# EAGLE design eagle (EAGLE 9.4.2)
CNAME: rk8 HAT; CREVISION: level 3; DESIGNER: Christophe VG
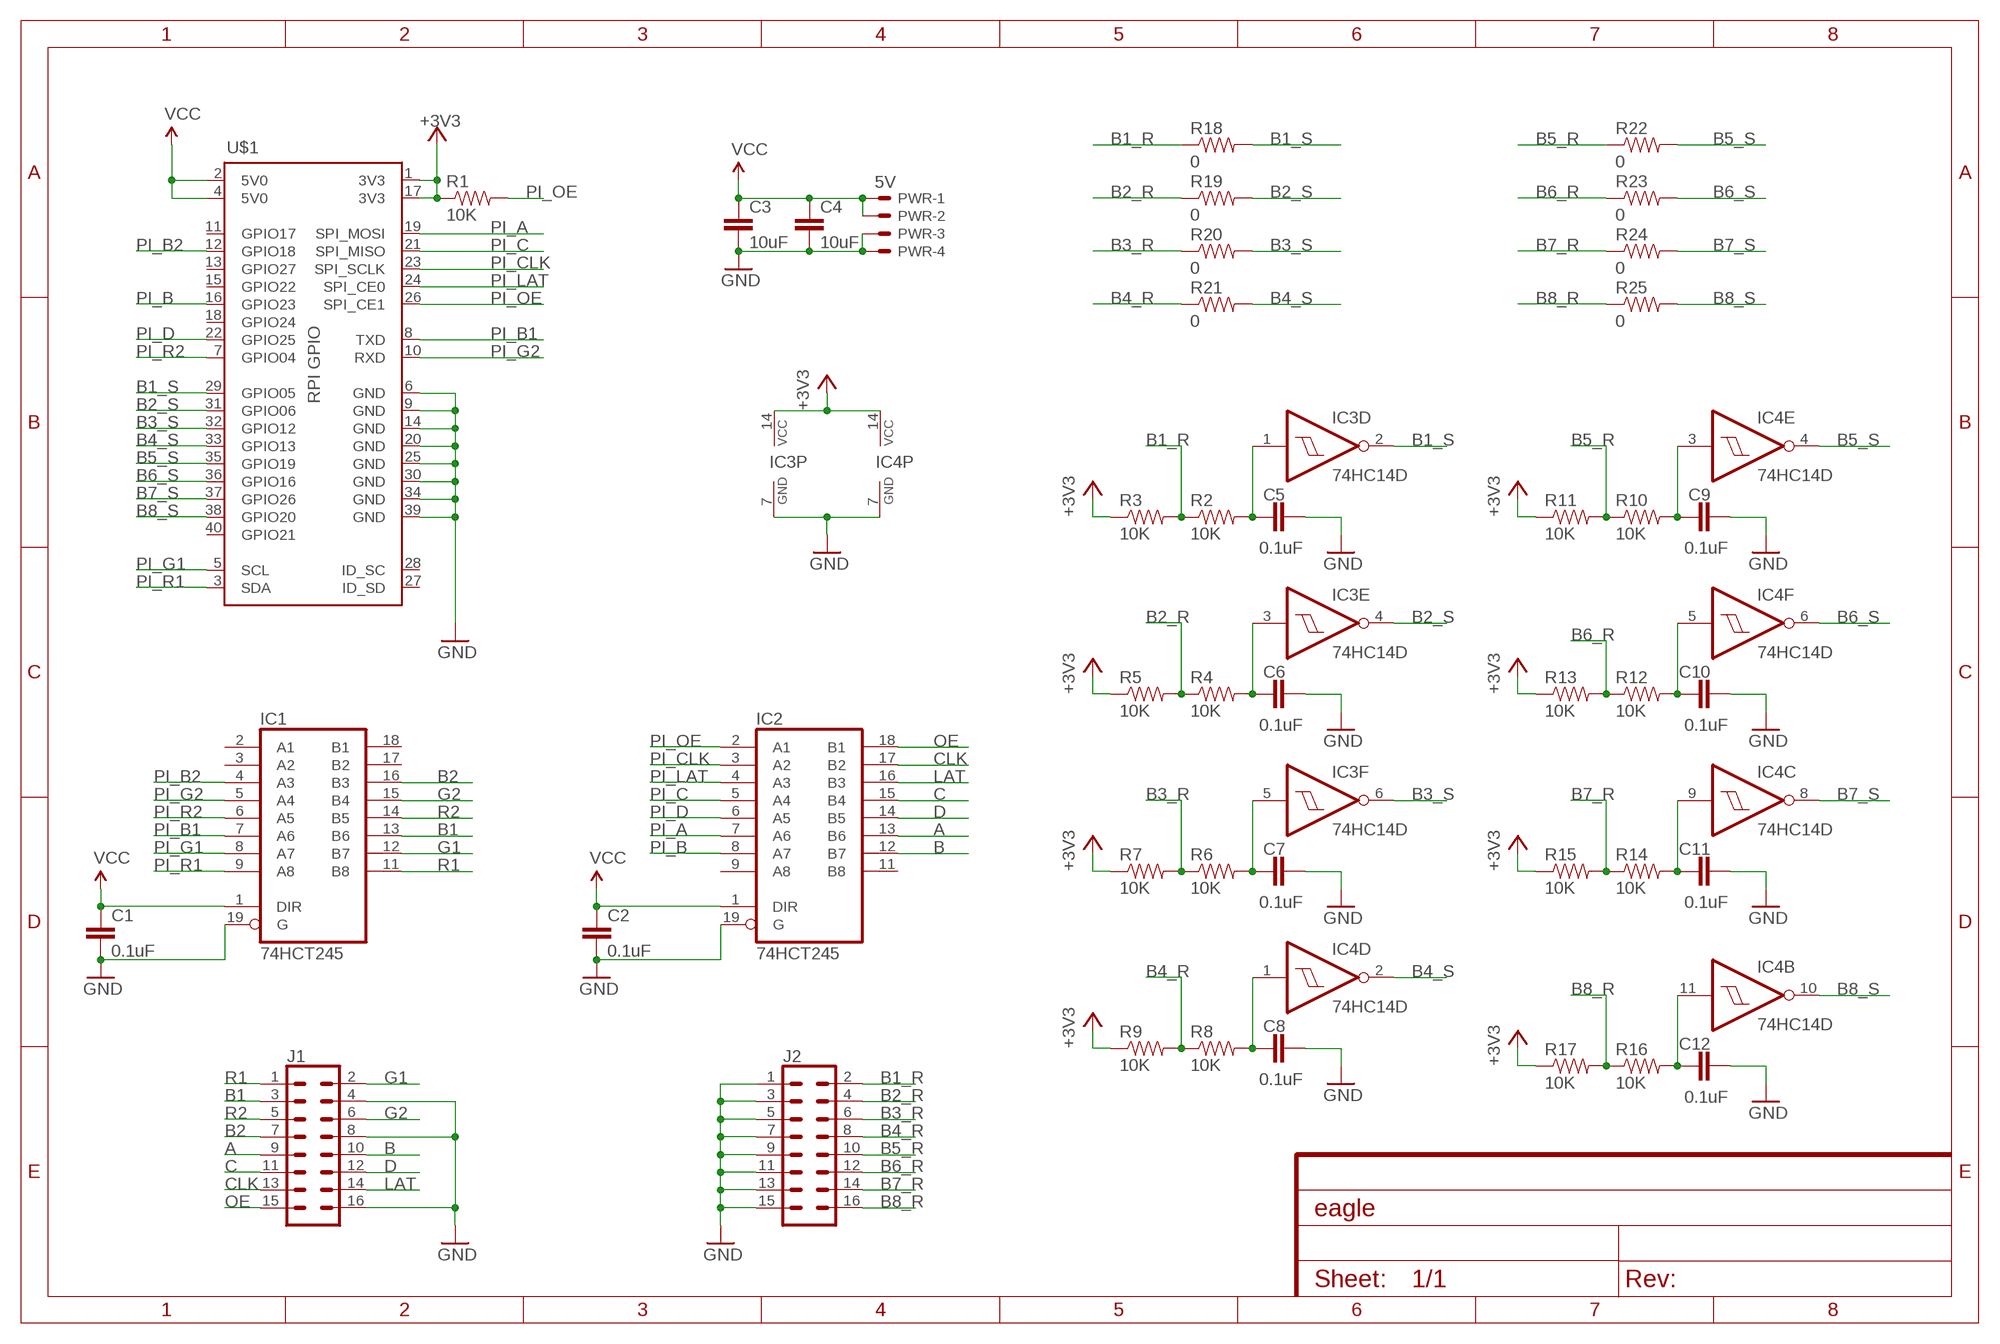
[diagram p0: schematic, sheet 1]

## Parts
C1  0.1uF  CAP0805  [0805]
C2  0.1uF  CAP0805  [0805]
C3  10uF  CAP0805  [0805]
C4  10uF  CAP0805  [0805]
C5  0.1uF  CAP0805  [0805]
C6  0.1uF  CAP0805  [0805]
C7  0.1uF  CAP0805  [0805]
C8  0.1uF  CAP0805  [0805]
C9  0.1uF  CAP0805  [0805]
C10  0.1uF  CAP0805  [0805]
C11  0.1uF  CAP0805  [0805]
C12  0.1uF  CAP0805  [0805]
IC1  74HCT245  74HCT245DW  [SO20W]
IC2  74HCT245  74HCT245DW  [SO20W]
IC3  74HC14D  [SO14]
IC4  74HC14D  [SO14]
J1  CONN_08X2_SHROUD  [2X8-SHROUDED_LOCK]
J2  CONN_08X2_SHROUD  [2X8-SHROUDED_LOCK]
PWR  5V  KK-156-4  [KK-156-4]
R1  10K  RESISTOR0805-RES  [0805]
R2  10K  RESISTOR0805-RES  [0805]
R3  10K  RESISTOR0805-RES  [0805]
R4  10K  RESISTOR0805-RES  [0805]
R5  10K  RESISTOR0805-RES  [0805]
R6  10K  RESISTOR0805-RES  [0805]
R7  10K  RESISTOR0805-RES  [0805]
R8  10K  RESISTOR0805-RES  [0805]
R9  10K  RESISTOR0805-RES  [0805]
R10  10K  RESISTOR0805-RES  [0805]
R11  10K  RESISTOR0805-RES  [0805]
R12  10K  RESISTOR0805-RES  [0805]
R13  10K  RESISTOR0805-RES  [0805]
R14  10K  RESISTOR0805-RES  [0805]
R15  10K  RESISTOR0805-RES  [0805]
R16  10K  RESISTOR0805-RES  [0805]
R17  10K  RESISTOR0805-RES  [0805]
R18  0  RESISTOR0805-RES  [0805]
R19  0  RESISTOR0805-RES  [0805]
R20  0  RESISTOR0805-RES  [0805]
R21  0  RESISTOR0805-RES  [0805]
R22  0  RESISTOR0805-RES  [0805]
R23  0  RESISTOR0805-RES  [0805]
R24  0  RESISTOR0805-RES  [0805]
R25  0  RESISTOR0805-RES  [0805]
U$1  RPI3_HATNO_DF  [RASPI_BOARD_B+HAT]

## Nets
+3V3: IC3.14(P:VCC) IC4.14(P:VCC) R1.1 R3.1 R5.1 R7.1 R9.1 R11.1 R13.1 R15.1 R17.1 U$1.1(3V3) U$1.17(3V3)
A: IC2.13(B6) J1.9
B: IC2.12(B7) J1.10
B1: IC1.13(B6) J1.3
B1_R: J2.2 R2.1 R3.2 R18.1
B1_S: IC3.2(D:O) R18.2 U$1.29(GPIO05)
B2: IC1.16(B3) J1.7
B2_R: J2.4 R4.1 R5.2 R19.1
B2_S: IC3.4(E:O) R19.2 U$1.31(GPIO06)
B3_R: J2.6 R6.1 R7.2 R20.1
B3_S: IC3.6(F:O) R20.2 U$1.32(GPIO12)
B4_R: J2.8 R8.1 R9.2 R21.1
B4_S: IC4.2(D:O) R21.2 U$1.33(GPIO13)
B5_R: J2.10 R10.1 R11.2 R22.1
B5_S: IC4.4(E:O) R22.2 U$1.35(GPIO19)
B6_R: J2.12 R12.1 R13.2 R23.1
B6_S: IC4.6(F:O) R23.2 U$1.36(GPIO16)
B7_R: J2.14 R14.1 R15.2 R24.1
B7_S: IC4.8(C:O) R24.2 U$1.37(GPIO26)
B8_R: J2.16 R16.1 R17.2 R25.1
B8_S: IC4.10(B:O) R25.2 U$1.38(GPIO20)
C: IC2.15(B4) J1.11
CLK: IC2.17(B2) J1.13
D: IC2.14(B5) J1.12
G1: IC1.12(B7) J1.2
G2: IC1.15(B4) J1.6
GND: C1.2 C2.2 C3.2 C4.2 C5.2 C6.2 C7.2 C8.2 C9.2 C10.2 C11.2 C12.2 IC1.19(G) IC2.19(G) IC3.7(P:GND) IC4.7(P:GND) J1.4 J1.8 J1.16 J2.1 J2.3 J2.5 J2.7 J2.9 J2.11 J2.13 J2.15 PWR.3 PWR.4 U$1.6(GND) U$1.9(GND) U$1.14(GND) U$1.20(GND) U$1.25(GND) U$1.30(GND) U$1.34(GND) U$1.39(GND)
LAT: IC2.16(B3) J1.14
N$1: C5.1 IC3.1(D:I) R2.2
N$2: C6.1 IC3.3(E:I) R4.2
N$3: C7.1 IC3.5(F:I) R6.2
N$4: C8.1 IC4.1(D:I) R8.2
N$5: C9.1 IC4.3(E:I) R10.2
N$6: C10.1 IC4.5(F:I) R12.2
N$7: C11.1 IC4.9(C:I) R14.2
N$8: C12.1 IC4.11(B:I) R16.2
OE: IC2.18(B1) J1.15
PI_A: IC2.7(A6) U$1.19(SPI_MOSI)
PI_B: IC2.8(A7) U$1.16(GPIO23)
PI_B1: IC1.7(A6) U$1.8(TXD)
PI_B2: IC1.4(A3) U$1.12(GPIO18)
PI_C: IC2.5(A4) U$1.21(SPI_MISO)
PI_CLK: IC2.3(A2) U$1.23(SPI_SCLK)
PI_D: IC2.6(A5) U$1.22(GPIO25)
PI_G1: IC1.8(A7) U$1.5(SCL)
PI_G2: IC1.5(A4) U$1.10(RXD)
PI_LAT: IC2.4(A3) U$1.24(SPI_CE0)
PI_OE: IC2.2(A1) R1.2 U$1.26(SPI_CE1)
PI_R1: IC1.9(A8) U$1.3(SDA)
PI_R2: IC1.6(A5) U$1.7(GPIO04)
R1: IC1.11(B8) J1.1
R2: IC1.14(B5) J1.5
VCC: C1.1 C2.1 C3.1 C4.1 IC1.1(DIR) IC2.1(DIR) PWR.1 PWR.2 U$1.2(5V0) U$1.4(5V0)
Unconnected: IC1.2(A1) IC1.3(A2) IC1.17(B2) IC1.18(B1) IC2.9(A8) IC2.11(B8) IC3.8(C:O) IC3.9(C:I) IC3.10(B:O) IC3.11(B:I) IC3.12(A:O) IC3.13(A:I) IC4.12(A:O) IC4.13(A:I) U$1.11(GPIO17) U$1.13(GPIO27) U$1.15(GPIO22) U$1.18(GPIO24) U$1.27(ID_SD) U$1.28(ID_SC) U$1.40(GPIO21)

## Power pins joined to a net without a drawn wire
GND: IC1.10(GND) IC2.10(GND)
VCC: IC1.20(VCC) IC2.20(VCC)

## Library data of the parts
C1-C12 = passive:CAP: Capacitor Standard 0603 ceramic capacitor, and 0.1" leaded capacitor.
IC1 IC2 = 74xx-eu:74*245: Octal BUS TRANSCEIVER, 3-state
IC3 IC4 = 74xx-eu:74*14: Hex schmitt trigger INVERTER
J1 J2 = SparkFun-Connectors:CONN_08X2: Multi connection point. Often used as Generic Header-pin footprint for 0.1 inch spaced/style header connections You can populate with any combo of single row headers, but if you'd like an exact match, check this: Header - 2x8 (Male, 0.1") <https://www.sparkfun.com/products/13156> (PRT-13156) On any of the 0.1 inch spaced packages, you can populate with these: Break Away Headers - Straight <https://www.sparkfun.com/products/116> (PRT-00116) Break Away Male Headers - Right Angle <https://www.sparkfun.com/products/553> (PRT-00553) Female Headers <https://www.sparkfun.com/products/115> (PRT-00115) Break Away Headers - Machine Pin <https://www.sparkfun.com/products/117> (PRT-00117) Break Away Female Headers - Swiss Machine Pin <https://www.sparkfun.com/products/743> (PRT-00743)
PWR = con-molex:KK-156-4: KK 156 HEADER Source: http://www.molex.com/pdm_docs/sd/026604100_sd.pdf; MF: MOLEX; OC_FARNELL: unknown; OC_NEWARK: unknown
R1-R25 = passive:RESISTOR: Resistor Basic schematic elements and footprints for 0603, 1206, and PTH resistors.
U$1 = rpi:RPI3_HAT

## Board
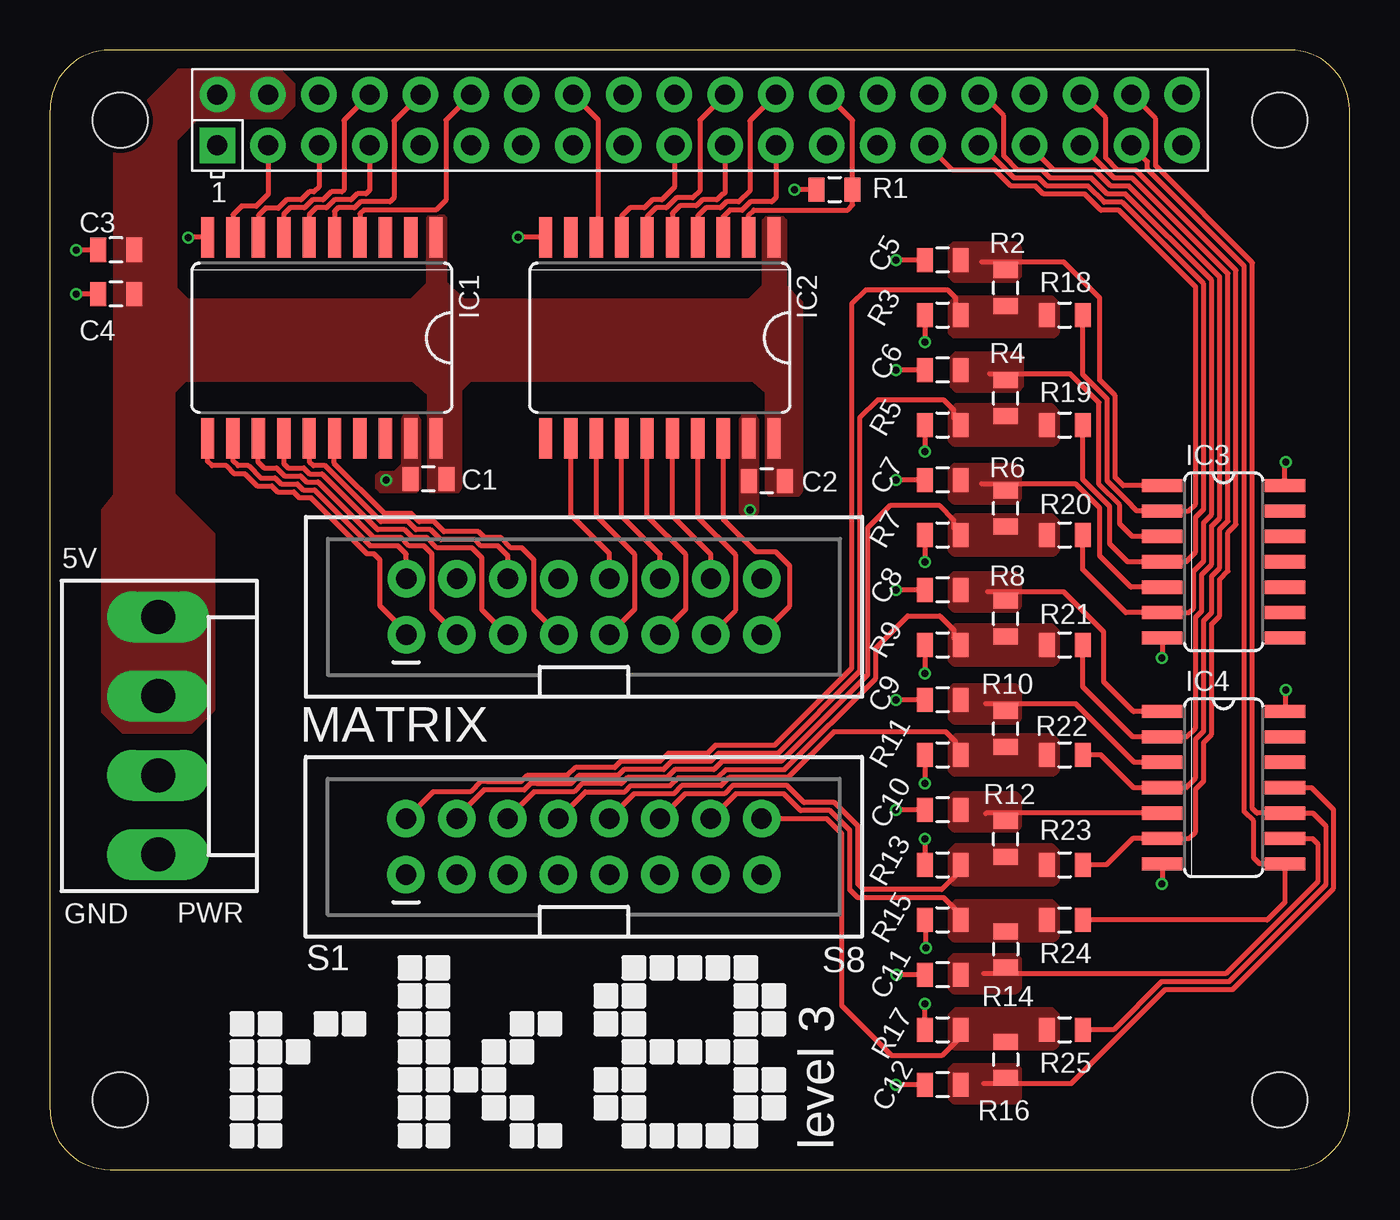
[diagram p1: board, top side]
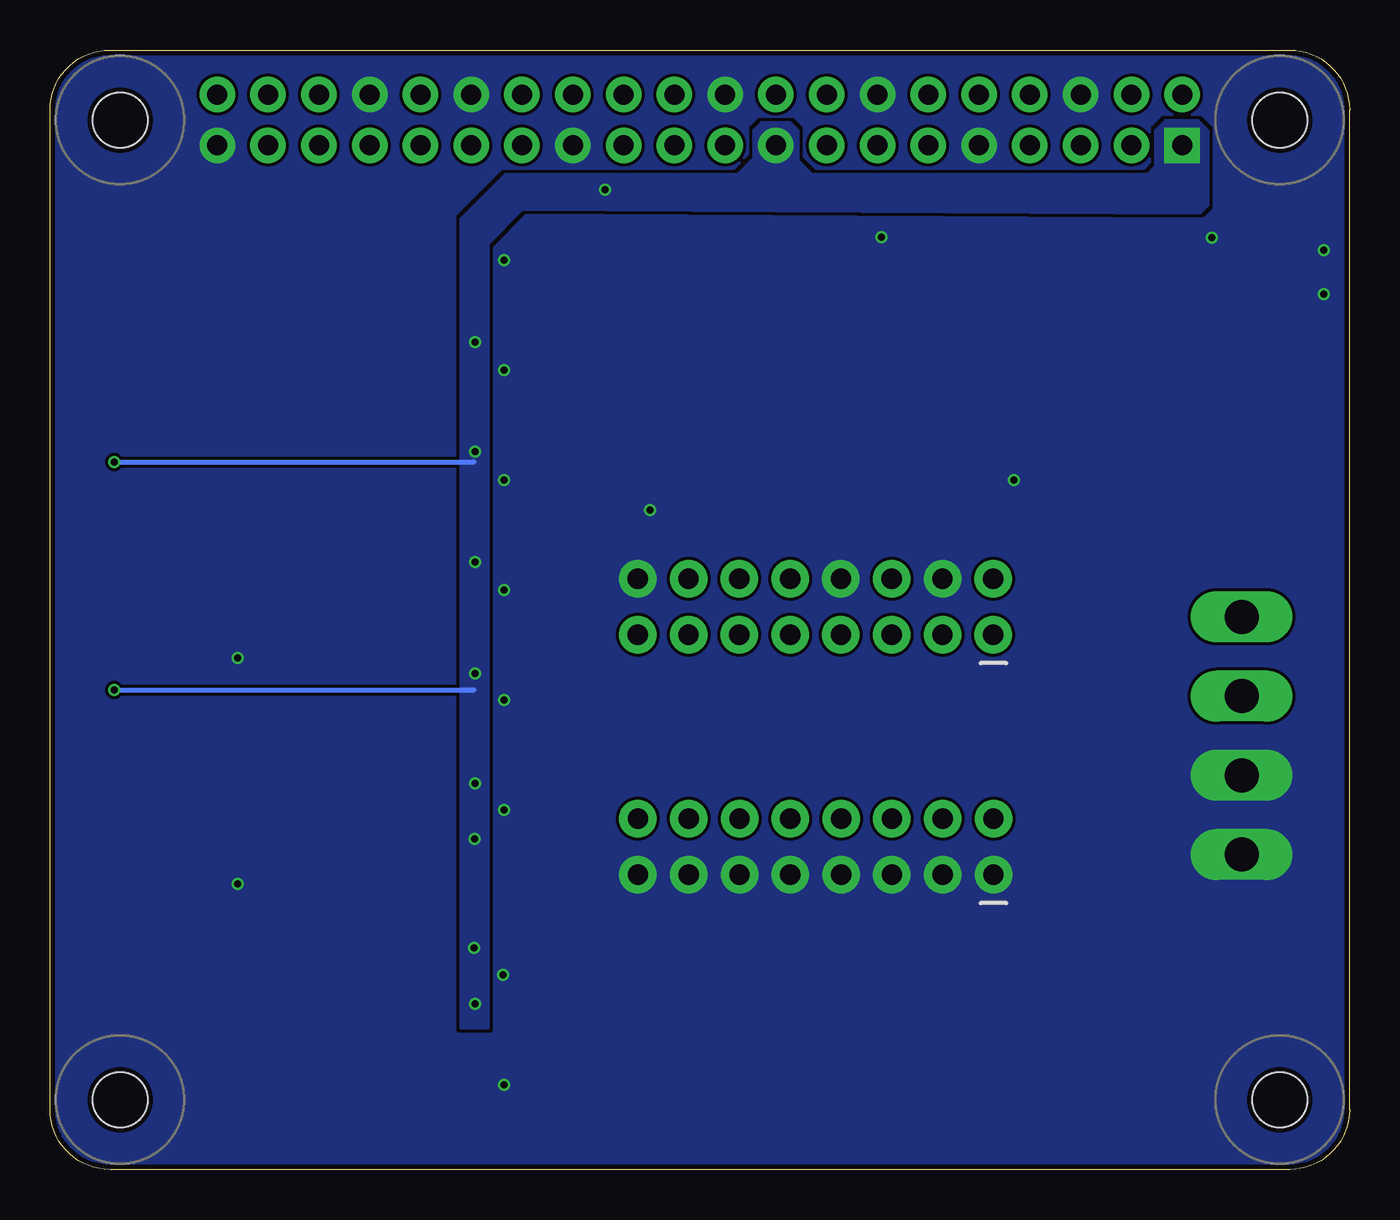
[diagram p2: board, bottom side, seen from below]

Size 65 x 56 mm. Coordinates in mm from the lower left corner, seen from the top.
Copper layers (1*16): Top 0.018mm / dielectric 1.55mm / Bottom 0.018mm
Design rules "eC_2Layer_PClass6_BaseCopperO18_eCDefault": minimum track width 0.15mm, minimum drill 0.35mm, track to track 0.15mm, track to pad 0.15mm, pad to pad 0.15mm, via to via 0.15mm, smd to smd 0mil, copper to edge 0.25mm, drill to drill 0.35mm, minimum pad ring 0.175mm, minimum via ring 0.125mm, stop-mask expansion 0mil, vias tented up to drill 0.45mm, thermal gap 0.2mm

### Footprints (pad centres in the part's own frame; a part is rotated, then mirrored left to right if it is on the bottom)
0805 = smd 0.8 x 1.2: 1 -0.9,0; 2 0.9,0
SO20W = smd 0.66 x 2.032: 1 -5.715,-5.029; 2 -4.445,-5.029; 3 -3.175,-5.029; 4 -1.905,-5.029; 5 -0.635,-5.029; 6 0.635,-5.029; 7 1.905,-5.029; 8 3.175,-5.029; 9 4.445,-5.029; 10 5.715,-5.029; 11 5.715,5.029; 12 4.445,5.029; 13 3.175,5.029; 14 1.905,5.029; 15 0.635,5.029; 16 -0.635,5.029; 17 -1.905,5.029; 18 -3.175,5.029; 19 -4.445,5.029; 20 -5.715,5.029
SO14 = smd 0.66 x 2.032: 1 -3.81,-3.073; 2 -2.54,-3.073; 3 -1.27,-3.073; 4 0,-3.073; 5 1.27,-3.073; 6 2.54,-3.073; 7 3.81,-3.073; 8 3.81,3.073; 9 2.54,3.073; 10 1.27,3.073; 11 0,3.073; 12 -1.27,3.073; 13 -2.54,3.073; 14 -3.81,3.073
2X8-SHROUDED_LOCK = drill 1.016 pad 1.88: 1 -1.397,8.89; 2 1.397,8.89; 3 -1.397,6.35; 4 1.397,6.35; 5 -1.397,3.81; 6 1.397,3.81; 7 -1.397,1.27; 8 1.397,1.27; 9 -1.397,-1.27; 10 1.397,-1.27; 11 -1.397,-3.81; 12 1.397,-3.81; 13 -1.397,-6.35; 14 1.397,-6.35; 15 -1.397,-8.89; 16 1.397,-8.89
KK-156-4 = drill 1.7 pad 2.184 long: 1 -5.94,0; 2 -1.98,0; 3 1.98,0; 4 5.94,0
RASPI_BOARD_B+HAT = drill 1 pad 1.778 square: 1 8.37,51.23 | drill 1 pad 1.778: 2 8.37,53.77; 3 10.91,51.23; 4 10.91,53.77; 5 13.45,51.23; 6 13.45,53.77; 7 15.99,51.23; 8 15.99,53.77; 9 18.53,51.23; 10 18.53,53.77; 11 21.07,51.23; 12 21.07,53.77; 13 23.61,51.23; 14 23.61,53.77; 15 26.15,51.23; 16 26.15,53.77; 17 28.69,51.23; 18 28.69,53.77; 19 31.23,51.23; 20 31.23,53.77; 21 33.77,51.23; 22 33.77,53.77; 23 36.31,51.23; 24 36.31,53.77; 25 38.85,51.23; 26 38.85,53.77; 27 41.39,51.23; 28 41.39,53.77; 29 43.93,51.23; 30 43.93,53.77; 31 46.47,51.23; 32 46.47,53.77; 33 49.01,51.23; 34 49.01,53.77; 35 51.55,51.23; 36 51.55,53.77; 37 54.09,51.23; 38 54.09,53.77; 39 56.63,51.23; 40 56.63,53.77 | hole 2.75: 3.5,3.5; 3.5,52.5; 61.5,3.5; 61.5,52.5

### Placement (x,y rotation side)
C1  18.93,34.54 180 top
C2  35.85,34.44 180 top
C3  3.3,46 180 top
C4  3.3,43.8 180 top
C5  44.65,45.5 180 top
C6  44.65,40 180 top
C7  44.65,34.5 180 top
C8  44.65,29 180 top
C9  44.65,23.5 180 top
C10  44.65,18 180 top
C11  44.65,9.75 180 top
C12  44.65,4.25 180 top
IC1  13.6,41.6 180 top
IC2  30.5,41.6 180 top
IC3  58.7,30.4 270 top
IC4  58.7,19.1 270 top
J1  26.71,28.15 90 top
J2  26.7,16.15 90 top
PWR  5.4,21.7 270 top
R1  39.24,49.02 0 top
R2  47.8,44.1 90 top
R3  44.65,42.75 0 top
R4  47.8,38.59 90 top
R5  44.65,37.25 0 top
R6  47.8,33.07 90 top
R7  44.65,31.75 0 top
R8  47.8,27.56 90 top
R9  44.65,26.25 0 top
R10  47.8,22.04 90 top
R11  44.65,20.75 0 top
R12  47.8,16.53 90 top
R13  44.65,15.25 0 top
R14  47.8,11.01 270 top
R15  44.65,12.5 0 top
R16  47.8,5.5 270 top
R17  44.65,7 0 top
R18  50.75,42.75 0 top
R19  50.75,37.25 0 top
R20  50.75,31.75 0 top
R21  50.75,26.25 0 top
R22  50.75,20.75 0 top
R23  50.75,15.25 0 top
R24  50.75,12.49 0 top
R25  50.75,7 0 top
U$1  0,0 0 top

### Tracks (layer width: path | path; a pad name or v marks a point on that pad's centre or on a via)
+3V3  (via drill 0.35)
  Top 0.254: R1.1 v37.24,49.02 | IC3.14 61.77,35.37 v61.8,35.4 | IC4.14 61.8,22.94 v61.8,24 | R3.1 v43.75,41.4 | R17.1 v43.75,8.3 | v43.8,11.1 43.8,12.45 R15.1 | v43.77,16.54 43.77,15.27 R13.1 | R11.1 v43.75,19.32 | R9.1 v43.75,24.81 | R7.1 v43.75,30.4 | R5.1 v43.75,35.92
  Bottom 0.254: v61.8,35.4 43.8,35.4 | v61.8,24 43.8,24
  pour Bottom (no thermals): 9.7,50.2 9.7,52 9.2,52.5 7.6,52.5 7.1,52 7.1,48.2 7.5,47.8 41.4,48 43.1,46.3 43.1,7.07 44.44,7.07 44.44,47.56 42.2,49.8 30.6,49.8 29.8,50.6 29.8,52 29.4,52.4 28,52.4 27.6,52 27.6,50.5 26.9,49.8 10.1,49.8
A
  Top 0.254: J1.9 29.26,28.03 29.26,30.75 27.32,32.69 IC2.13
B
  Top 0.254: J1.10 27.98,30.82 26.05,32.74 IC2.12
B1
  Top 0.254: J1.3 20.35,26.75 19.1,28 19.1,30.8 18.7,31.2 17.97,31.2 17.57,31.6 16.2,31.6 13.4,34.4 12.83,34.4 12.53,34.7 11.73,34.7 11.33,35.1 10.7,35.1 10.4,35.4 10.4,36.55 IC1.13
B1_R
  Top 0.254: R3.2 45.3,43 45.3,43.6 44.9,44 40.8,44 40.09,43.29 40.09,25.07 36.24,21.22 33.28,21.22 32.88,20.82 30.93,20.82 30.52,20.42 28.55,20.42 28.24,20.11 26.28,20.11 25.87,19.7 24.54,19.7 24.54,19.71 23.86,19.71 23.55,19.39 21.88,19.39 21.87,19.4 21.53,19.4 21.03,18.9 19.16,18.9 J2.2
  pour Top (no thermals): 50.1,43.6 45.3,43.6 45,43.3 45,41.9 45.2,41.7 50.2,41.7 50.4,41.9 50.4,43.3
B1_S
  Top 0.254: R18.2 51.65,39.76 52.88,38.54 52.88,34.44 54.11,33.2 54.11,33.19 54.36,32.94 IC3.2 56.94,32.94 57.3,33.3 57.3,44.14 53.46,47.98 52.56,47.98 51.76,48.79 49.7,48.79 49.29,49.19 48.06,49.19 47.26,50 45.16,50 U$1.29
B2
  Top 0.254: J1.7 24.2,27.99 24.2,30.5 23.6,31.1 23.07,31.1 22.57,31.6 21.74,31.6 21.43,31.91 19.71,31.91 19.2,32.41 18.47,32.41 18.07,32.82 16.73,32.82 14.22,35.32 14.22,36.56 IC1.16
B2_R
  Top 0.254: R5.2 45.2,37.6 45.2,38 44.7,38.5 41.4,38.5 40.49,37.59 40.49,24.91 36.41,20.82 33.45,20.82 33.05,20.42 31.09,20.42 30.69,20.01 28.71,20.01 28.41,19.71 26.45,19.71 26.04,19.3 24.37,19.3 24.03,19.3 23.71,18.99 21.71,18.99 21.7,19 20.35,17.65 J2.4
  pour Top (no thermals): 50.1,38.2 45.3,38.2 45,37.9 45,36.5 45.2,36.3 50.2,36.3 50.4,36.5 50.4,37.9
B2_S
  Top 0.254: R19.2 51.65,34.52 53,33.17 53,31.3 53.9,30.4 IC3.4 56.8,30.4 57.3,30.9 57.3,32.63 57.7,33.03 57.7,44.31 53.63,48.38 52.73,48.38 51.92,49.19 49.87,49.19 49.46,49.6 48.23,49.6 46.6,51.23 U$1.31
B3_R
  Top 0.254: R7.2 45.2,32.1 45.2,32.5 44.5,33.2 42,33.2 40.9,32.1 40.9,24.74 36.57,20.42 33.62,20.42 33.21,20.01 31.26,20.01 30.86,19.61 28.89,19.61 28.58,19.3 26.62,19.3 26.21,18.89 24.21,18.89 24.2,18.9 22.89,17.59 J2.6
  pour Top (no thermals): 50.1,32.7 45.3,32.7 45,32.4 45,31 45.2,30.8 50.2,30.8 50.4,31 50.4,32.4
B3_S
  Top 0.254: R20.2 51.65,30.01 53.8,27.86 IC3.6 56.96,27.86 57.2,28.1 57.2,29.93 57.7,30.43 57.7,32.36 58.11,32.77 58.11,44.48 53.8,48.79 52.9,48.79 52.09,49.6 50.03,49.6 49.63,50 48.4,50 47.7,50.7 47.7,52.7 46.63,53.77 U$1.32
B4_R
  Top 0.254: R9.2 45.2,26.6 45.2,27 44.5,27.7 42.9,27.7 41.3,26.1 41.3,24.57 36.74,20.01 33.8,20.01 33.4,19.61 31.43,19.61 31.02,19.2 29.06,19.2 28.75,18.9 26.78,18.9 J2.8
  pour Top (no thermals): 50.1,27.2 45.3,27.2 45,26.9 45,25.5 45.2,25.3 50.2,25.3 50.4,25.5 50.4,26.9
B4_S
  Top 0.254: R21.2 51.65,24.14 54.15,21.64 IC4.2 56.84,21.64 57.3,22.1 57.3,27.63 57.6,27.93 57.6,29.76 58.11,30.27 58.11,32.19 58.51,32.6 58.51,44.65 53.97,49.19 53.06,49.19 52.26,50 50.2,50 49.01,51.19 U$1.33
B5_R
  Top 0.254: R11.2 45.3,21 45.3,21.4 44.8,21.9 39.2,21.9 36.91,19.61 33.97,19.61 33.56,19.2 31.6,19.2 31.19,18.8 29.22,18.8 J2.10
  pour Top (no thermals): 50.1,21.7 45.3,21.7 45,21.4 45,20 45.2,19.8 50.2,19.8 50.4,20 50.4,21.4
B5_S
  Top 0.254: R22.2 52.55,20.75 54.2,19.1 IC4.4 56.8,19.1 57.3,19.6 57.3,21.53 57.7,21.93 57.7,27.46 58.1,27.86 58.1,29.69 58.51,30.1 58.51,32.03 58.92,32.43 58.92,44.81 54.13,49.6 53.23,49.6 51.6,51.23 U$1.35
B6_R
  Top 0.254: R13.2 45.55,14.95 44.6,14 40.7,14 40.41,14.29 40.41,17.19 39.24,18.36 37.72,18.36 36.87,19.2 34.14,19.2 33.73,18.8 31.76,18.8 J2.12
  pour Top (no thermals): 50.1,16.2 45.3,16.2 45,15.9 45,14.5 45.2,14.3 50.2,14.3 50.4,14.5 50.4,15.9
B6_S
  Top 0.254: R23.2 52.85,15.25 54.16,16.56 IC4.6 56.96,16.56 57.3,16.9 57.3,19.03 57.7,19.43 57.7,21.36 58.11,21.77 58.11,27.29 58.5,27.69 58.5,29.52 58.92,29.93 58.92,31.86 59.32,32.26 59.32,44.98 54.3,50 53.4,50 52.8,50.6 52.8,52.6 51.63,53.77 U$1.36
B7_R
  Top 0.254: R15.2 45.55,12.75 44.7,13.6 40.4,13.6 40,14 40,16.97 39.02,17.95 37.55,17.95 36.7,18.8 34.3,18.8 J2.14
  pour Top (no thermals): 50.1,13.4 45.3,13.4 45,13.1 45,11.7 45.2,11.5 50.2,11.5 50.4,11.7 50.4,13.1
B7_S
  Top 0.254: R24.2 60.89,12.49 61.77,13.37 IC4.8 60.51,15.29 60.2,15.6 60.2,17.43 59.74,17.89 59.74,45.19 54.9,50.03 54.9,50.42 U$1.37
B8_R
  Top 0.254: R17.2 45.55,6.65 44.6,5.7 42.1,5.7 39.6,8.2 39.6,16.8 38.85,17.55 J2.16
  pour Top (no thermals): 50.1,8 45.3,8 45,7.7 45,6.3 45.2,6.1 50.2,6.1 50.4,6.3 50.4,7.7
B8_S
  Top 0.254: R25.2 53.2,7 55.6,9.4 58.97,9.4 63.8,14.23 63.8,17.2 63.17,17.83 IC4.10 60.37,17.83 60.14,18.06 60.14,45.36 55.3,50.2 55.3,52.56 U$1.38
C
  Top 0.254: J1.11 31.8,28.03 31.8,30.76 29.86,32.69 IC2.15
CLK
  Top 0.254: J1.13 34.3,27.99 34.3,30.73 32.41,32.62 IC2.17
D
  Top 0.254: J1.12 30.52,30.77 28.59,32.69 IC2.14
G1
  Top 0.254: J1.2 17.82,30.78 17.4,31.2 16.03,31.2 13.24,33.99 12.66,33.99 12.36,34.29 11.56,34.29 11.26,34.6 10.53,34.6 9.93,35.2 9.4,35.2 9.15,35.45 IC1.12
G2
  Top 0.254: J1.6 22.9,30.7 22.4,31.2 21.57,31.2 21.27,31.5 19.54,31.5 19.04,32.01 18.31,32.01 17.9,32.41 16.56,32.41 13.77,35.2 13.17,35.2 12.97,35.4 IC1.15
GND  (via drill 0.35)
  Top 0.254: IC2.10 v23.42,46.63 | C3.2 v1.3,46 | C4.2 v1.3,43.8 | IC3.7 55.63,25.63 v55.6,25.6 | IC4.7 55.63,14.33 v55.6,14.3 | C12.2 v42.3,4.25 | C11.2 v42.34,9.75 v42.33,9.74 | C10.2 v42.3,18 | C9.2 v42.3,23.5 | C8.2 v42.3,29 | C7.2 v42.3,34.5 | C6.2 v42.3,40 | v42.3,40 | C5.2 v42.3,45.5 | v42.3,45.5 | IC1.10 6.93,46.63 v6.9,46.6
  other vias: 35,33 16.8,34.5
  pour Bottom (rank 2, no thermals): 0.01,56.04 0.01,-0.06 65.16,0.04 64.96,56.04
  pour Top (no thermals): 35.35,37.5 35.2,37.7 34.7,37.7 34.56,37.5 34.56,32.9 34.7,32.7 35.2,32.7 35.35,32.9
  pour Top (no thermals): 18.37,37.7 17.7,37.7 17.6,37.55 17.6,35.3 17.2,34.9 16.5,34.9 16.3,34.7 16.3,34.1 16.5,33.9 18.3,33.9 18.5,34.1 18.5,37.5
LAT
  Top 0.254: J1.14 33.06,30.77 31.14,32.69 IC2.16
N$1
  Top 0.254: IC3.1 53.67,34.21 53.28,34.61 53.28,38.71 52.5,39.48 52.5,43.6 50.7,45.4 46.6,45.4
  pour Top (no thermals): 48.3,46.3 45.2,46.3 45,46.1 45,44.7 45.2,44.5 48.3,44.5 48.5,44.7 48.5,46.1
N$2
  Top 0.254: IC3.3 54.13,31.67 53.51,32.29 53.51,33.23 52.47,34.27 52.47,38.37 51.04,39.8 47,39.8
  pour Top (no thermals): 48.4,40.8 45.3,40.8 45.1,40.6 45.1,39.2 45.3,39 48.4,39 48.6,39.2 48.6,40.6
N$3
  Top 0.254: IC3.5 54.07,29.13 52.5,30.7 52.5,33.1 51.3,34.3 46.6,34.3
  pour Top (no thermals): 48.3,35.2 45.2,35.2 45,35 45,33.6 45.2,33.4 48.3,33.4 48.5,33.6 48.5,35
N$4
  Top 0.254: IC4.1 54.19,22.91 52.7,24.4 52.7,26.9 50.7,28.9 46.9,28.9
  pour Top (no thermals): 48.3,29.8 45.2,29.8 45,29.6 45,28.2 45.2,28 48.3,28 48.5,28.2 48.5,29.6
N$5
  Top 0.254: IC4.3 54.23,20.37 51.3,23.3 46.8,23.3
  pour Top (no thermals): 48.3,24.2 45.2,24.2 45,24 45,22.6 45.2,22.4 48.3,22.4 48.5,22.6 48.5,24
N$6
  Top 0.254: IC4.5 46.83,17.83 46.8,17.8
  pour Top (no thermals): 48.3,18.8 45.2,18.8 45,18.6 45,17.2 45.2,17 48.3,17 48.5,17.2 48.5,18.6
N$7
  Top 0.254: IC4.9 63.14,16.56 63.4,16.3 63.4,14.4 58.8,9.8 46.7,9.8
  pour Top (no thermals): 48.3,10.7 45.2,10.7 45,10.5 45,9.1 45.2,8.9 48.3,8.9 48.5,9.1 48.5,10.5
N$8
  Top 0.254: IC4.11 63.1,19.1 64.21,17.99 64.21,14.06 59.13,8.99 55.76,8.99 51.07,4.3 46.7,4.3
  pour Top (no thermals): 48.3,5.2 45.2,5.2 45,5 45,3.6 45.2,3.4 48.3,3.4 48.5,3.6 48.5,5
OE
  Top 0.254: J1.15 35.6,26.8 37,28.2 37,30.2 36.3,30.9 35.3,30.9 33.67,32.52 IC2.18
PI_A
  Top 0.254: U$1.19 31.23,49.13 30.6,48.5 30.13,48.5 29.73,48.1 29,48.1 28.59,47.7 IC2.7
PI_B
  Top 0.254: U$1.16 27.4,52.52 27.4,46.7 IC2.8
PI_B1
  Top 0.254: U$1.8 14.7,52.48 14.7,49 14.61,48.91 14.06,48.91 13.66,48.5 13.13,48.5 12.73,48.1 12,48.1 11.7,47.8 IC1.7
PI_B2
  Top 0.254: U$1.12 19.8,52.5 19.8,48.5 19.3,48 15.7,48 15.51,47.8 IC1.4
PI_C
  Top 0.254: U$1.21 33.77,48.87 33.71,48.81 33.66,48.81 33.36,48.5 32.63,48.5 32.33,48.2 31.5,48.2 31.14,47.84 IC2.5
PI_CLK
  Top 0.254: IC2.3 33.67,47.67 34,48 34.01,47.99 34.61,47.99 35.03,48.4 36.1,48.4 36.31,48.61 U$1.23
PI_D
  Top 0.254: U$1.22 32.5,52.5 32.5,48.94 32.16,48.6 31.33,48.6 30.83,48.1 30.3,48.1 29.86,47.66 IC2.6
PI_G1
  Top 0.254: IC1.8 10.43,47.73 10.8,48.1 10.81,48.09 11.41,48.09 11.83,48.5 12.56,48.5 12.96,48.91 13.21,48.91 13.45,49.15 U$1.5
PI_G2
  Top 0.254: U$1.10 17.2,52.44 17.2,48.6 17,48.4 15.53,48.4 15.23,48.1 14.4,48.1 14.23,47.94 IC1.5
PI_LAT
  Top 0.254: IC2.4 32.41,47.7 32.8,48.1 33.53,48.1 33.83,48.4 34.46,48.4 35,48.94 35,52.46 U$1.24
PI_OE
  Top 0.254: IC2.2 34.95,47.74 35.2,48 39.9,48 40.14,48.24 R1.2 40.14,52.48 U$1.26
PI_R1
  Top 0.254: U$1.3 10.92,51.22 10.92,48.8 10.31,48.19 9.61,48.19 9.6,48.2 9.15,47.76 IC1.9
PI_R2
  Top 0.254: U$1.7 15.99,48.99 15.81,48.81 15.37,48.81 15.06,48.5 14.23,48.5 13.83,48.1 13.3,48.1 12.96,47.77 IC1.6
R1
  Top 0.254: J1.1 17.82,26.88 16.5,28.2 16.5,30.5 16.2,30.8 15.86,30.8 13.07,33.59 12.5,33.59 12.2,33.89 11.4,33.89 11.09,34.19 10.37,34.19 9.76,34.8 9.23,34.8 8.83,35.2 8.1,35.2 7.88,35.41 IC1.11
R2
  Top 0.254: J1.5 22.85,26.75 21.6,28 21.6,30.6 21.1,31.1 19.37,31.1 18.87,31.6 18.14,31.6 17.73,32.01 16.39,32.01 13.6,34.8 13,34.8 12.7,35.1 11.9,35.1 11.7,35.3 IC1.14
VCC
  pour Top (no thermals): 12.2,53.2 12.2,54.3 11.5,55 6.4,55 3.2,51.8 3.2,33.7 2.6,32.95 2.6,22.9 3.6,21.9 7.1,21.9 8.2,23 8.2,31.8 6.2,33.8 6.2,38.9 6.8,39.5 37.3,39.5 37.6,39.8 37.6,43.4 37.5,43.5 6.9,43.5 6.3,44.1 6.3,51.5 7.4,52.6 11.6,52.6
  pour Top (no thermals): 18.96,47.7 19.7,47.7 19.8,47.6 19.8,44.4 20.75,43.45 20.5,43.2 18.1,43.2 17.9,43.4 18.85,44.35 18.85,47.59
  pour Top (no thermals): 35.86,47.7 36.6,47.7 36.8,47.5 36.8,44.2 37.5,43.5 37.5,43.3 37.4,43.2 35,43.2 34.8,43.4 35.65,44.25 35.65,47.49
  pour Top (no thermals): 20.41,33.9 19,33.9 18.9,34.1 18.9,38.8 18.1,39.5 18.1,39.8 18.2,39.9 21.5,39.9 20.55,38.95 20.55,34.11
  pour Top (no thermals): 37.44,33.7 35.95,33.7 35.8,33.9 35.8,38.9 35,39.6 35,39.8 35.1,39.9 37.5,39.9 37.61,39.82 37.62,33.93 37.62,33.93

### Text on the board
tNames: MATRIX | GND | S1 | S8 | level 3